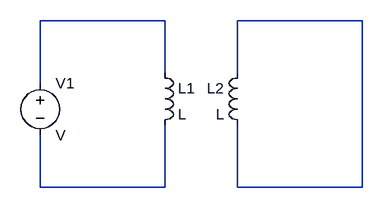
[diagram p0: schematic CenterTappedTransformer.asc]
CenterTappedTransformer.asc, the LTspice schematic file:
Version 4
SHEET 1 880 680
WIRE 192 16 0 16
WIRE 496 16 304 16
WIRE 192 96 192 16
WIRE 304 96 304 16
WIRE 0 112 0 16
WIRE 0 272 0 192
WIRE 192 272 192 176
WIRE 192 272 0 272
WIRE 304 272 304 176
WIRE 496 272 496 16
WIRE 496 272 304 272
SYMBOL voltage 0 96 R0
SYMATTR InstName V1
SYMBOL ind 176 80 R0
SYMATTR InstName L1
SYMBOL ind 320 80 M0
SYMATTR InstName L2

The netlist it stands for:
* CenterTappedTransformer.asc
V1 N001 N003 V
L1 N001 N003 L
L2 N002 N002 L
.backanno
.end